# EAGLE design AIM65_FRAM (EAGLE 9.5.2)
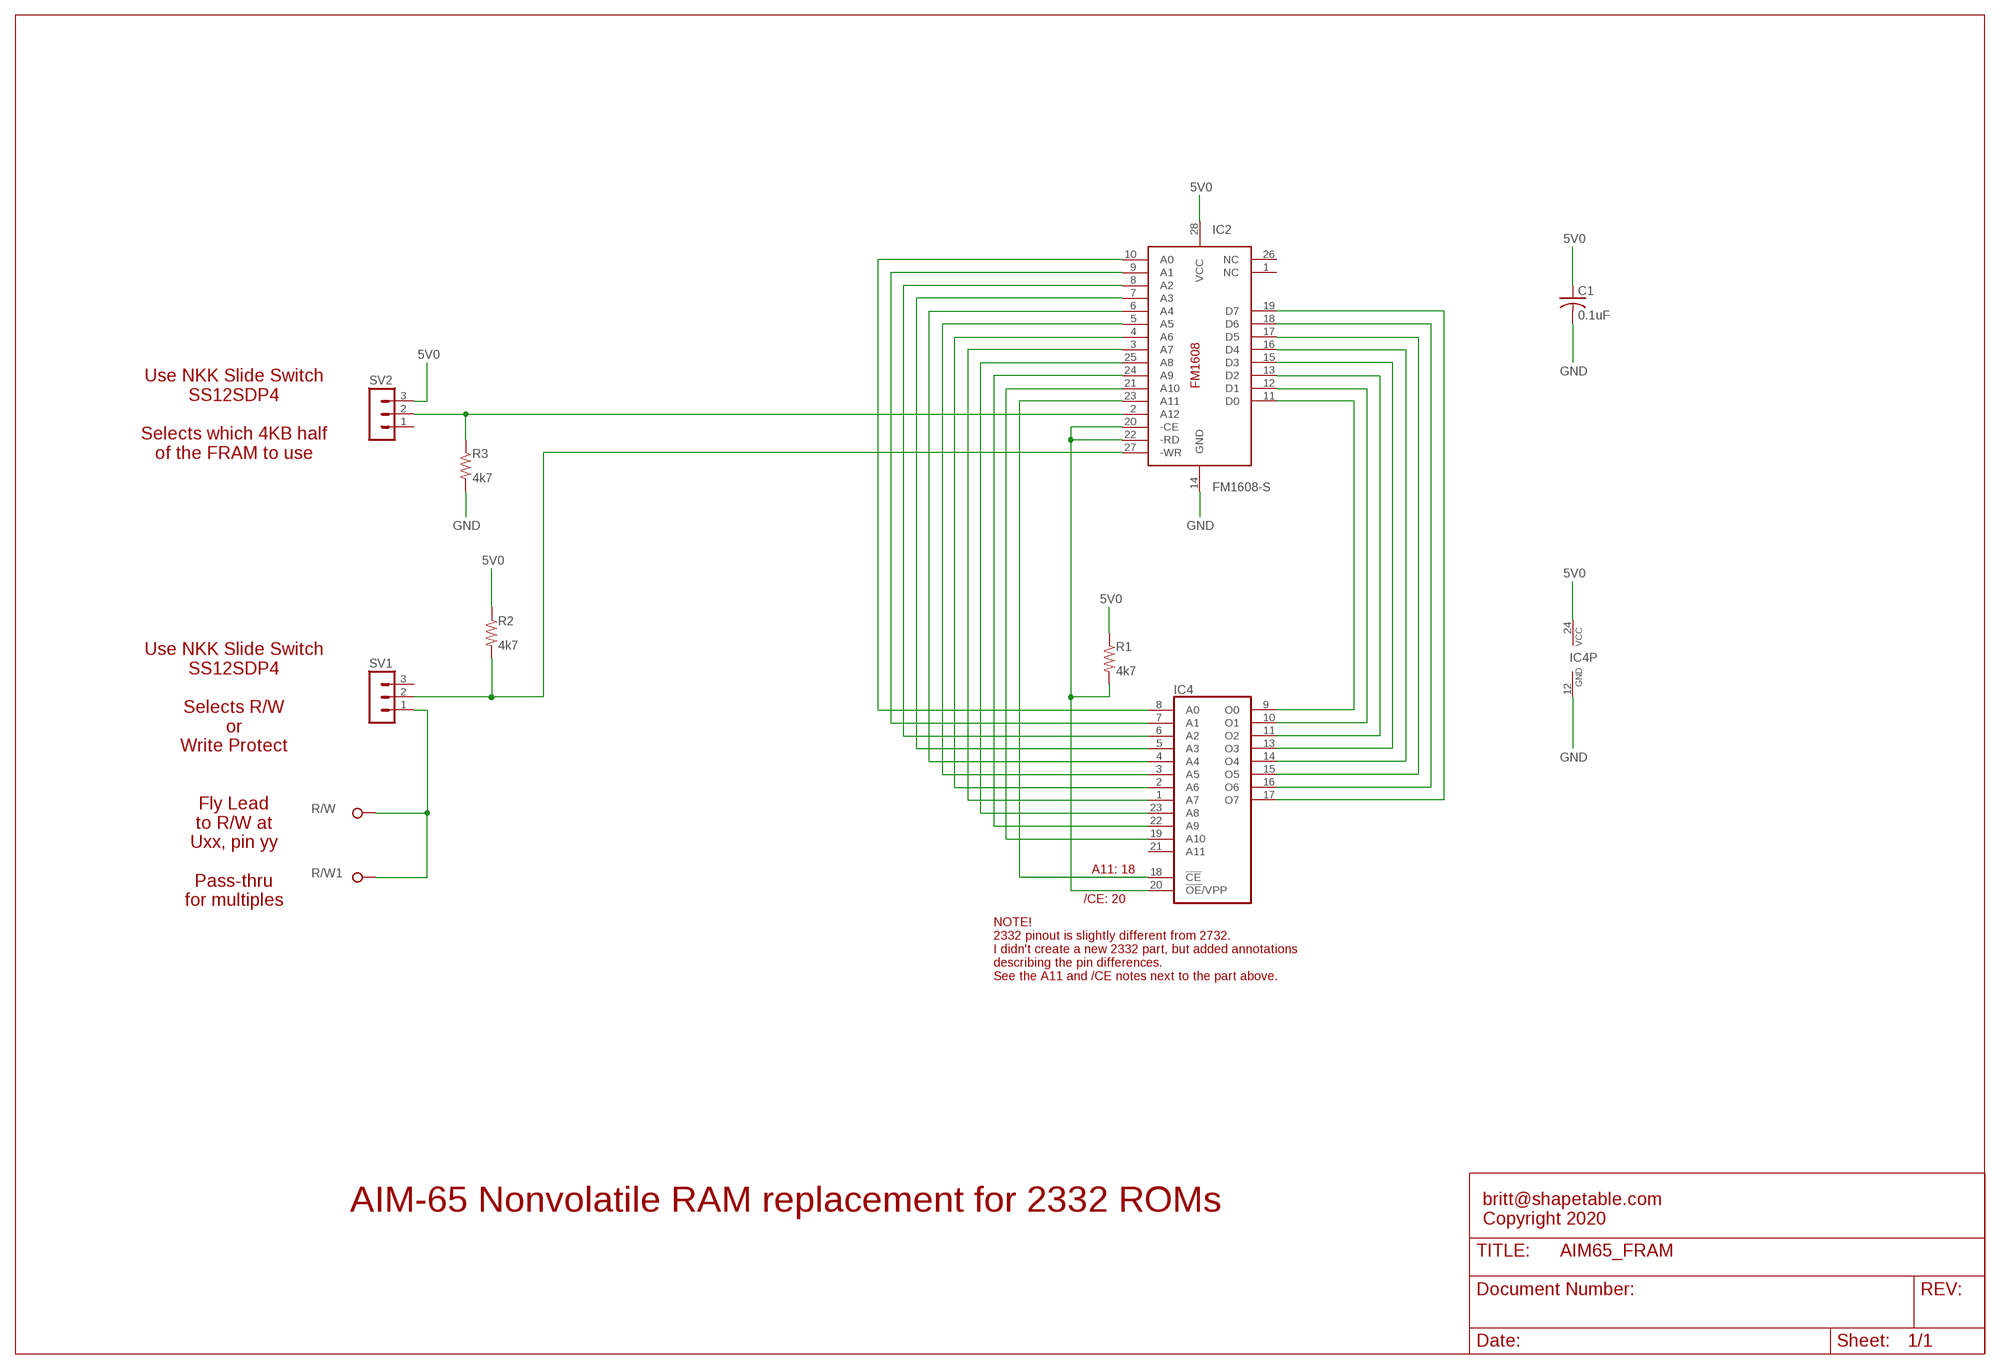
[diagram p0: schematic, sheet 1]

## Parts
C1  0.1uF  C-USC0603K  [C0603K]
IC2  FM1608-S  [SO-28W]
IC4  2732  [DIL24]
R1  4k7  R-US_R0603  [R0603]
R2  4k7  R-US_R0603  [R0603]
R3  4k7  R-US_R0603  [R0603]
R/W  JOE-TP-BIG  [JOE-TP-PKG-BIG]
R/W1  JOE-TP-BIG  [JOE-TP-PKG-BIG]
SV1  MA03-1  [MA03-1]
SV2  MA03-1  [MA03-1]

## Nets
5V0: C1.1 IC2.28(VCC) IC4.24(VCC) R1.1 R2.1 SV2.3
GND: C1.2 IC2.14(GND) IC4.12(GND) R3.2
N$1: IC2.10(A0) IC4.8(A0)
N$2: IC2.9(A1) IC4.7(A1)
N$3: IC2.8(A2) IC4.6(A2)
N$4: IC2.7(A3) IC4.5(A3)
N$5: IC2.6(A4) IC4.4(A4)
N$6: IC2.5(A5) IC4.3(A5)
N$7: IC2.4(A6) IC4.2(A6)
N$8: IC2.3(A7) IC4.1(A7)
N$9: IC2.25(A8) IC4.23(A8)
N$10: IC2.24(A9) IC4.22(A9)
N$11: IC2.21(A10) IC4.19(A10)
N$12: IC2.23(A11) IC4.18(!CE)
N$13: IC2.2(A12) R3.1 SV2.2
N$14: R/W1.1 R/W.1 SV1.1
N$15: IC2.20(-CE) IC2.22(-RD) IC4.20(!OE!/VPP) R1.2
N$16: IC2.27(-WR) R2.2 SV1.2
N$17: IC2.19(D7) IC4.17(O7)
N$18: IC2.18(D6) IC4.16(O6)
N$19: IC2.17(D5) IC4.15(O5)
N$20: IC2.16(D4) IC4.14(O4)
N$21: IC2.15(D3) IC4.13(O3)
N$22: IC2.13(D2) IC4.11(O2)
N$23: IC2.12(D1) IC4.10(O1)
N$24: IC2.11(D0) IC4.9(O0)
Unconnected: IC2.1(NC) IC2.26(NC) IC4.21(A11) SV1.3 SV2.1

## Notes on the sheet
- Use NKK Slide Switch
  SS12SDP4
  
  Selects which 4KB half
  of the FRAM to use
- Use NKK Slide Switch
  SS12SDP4
  
  Selects R/W
  or
  Write Protect
- Fly Lead
  to R/W at
  Uxx, pin yy
  
  Pass-thru
  for multiples
- A11: 18
- /CE: 20
- NOTE!
  2332 pinout is slightly different from 2732.
  I didn't create a new 2332 part, but added annotations
  describing the pin differences.
  See the A11 and /CE notes next to the part above.
- AIM-65 Nonvolatile RAM replacement for 2332 ROMs
- britt@shapetable.com
  Copyright 2020

## Library data of the parts
C1 = rcl:C-US: CAPACITOR, American symbol
IC2 = ramtron-2:FM1608: FM1608 8k x 8 NVRAM 5V (Jedec) DIP/SO-28W
IC4 = memory:2732: MEMORY
R1-R3 = rcl:R-US_: RESISTOR, American symbol
R/W R/W1 = joe-tp:JOE-TP-BIG
SV1 SV2 = con-lstb:MA03-1: PIN HEADER; OC_FARNELL: unknown; OC_NEWARK: unknown

## Board
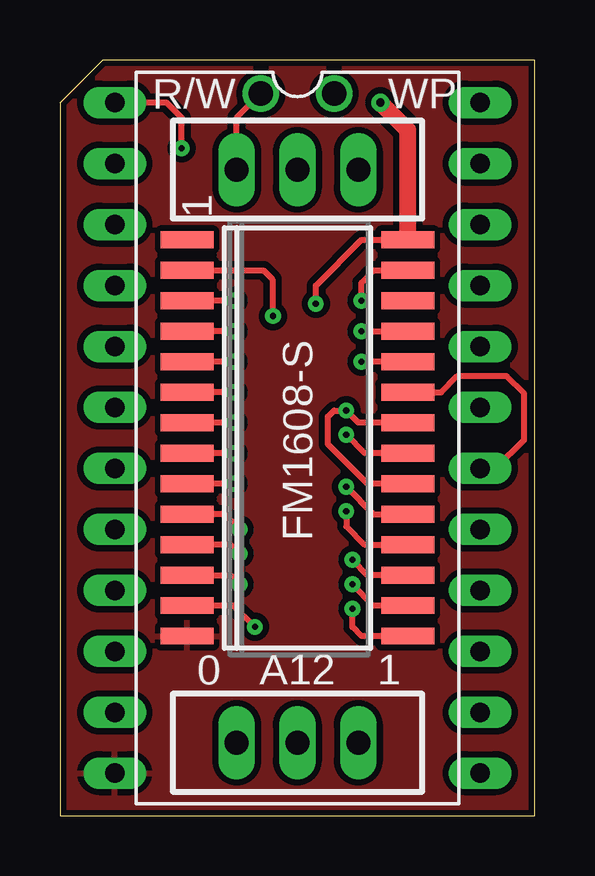
[diagram p1: board, top side]
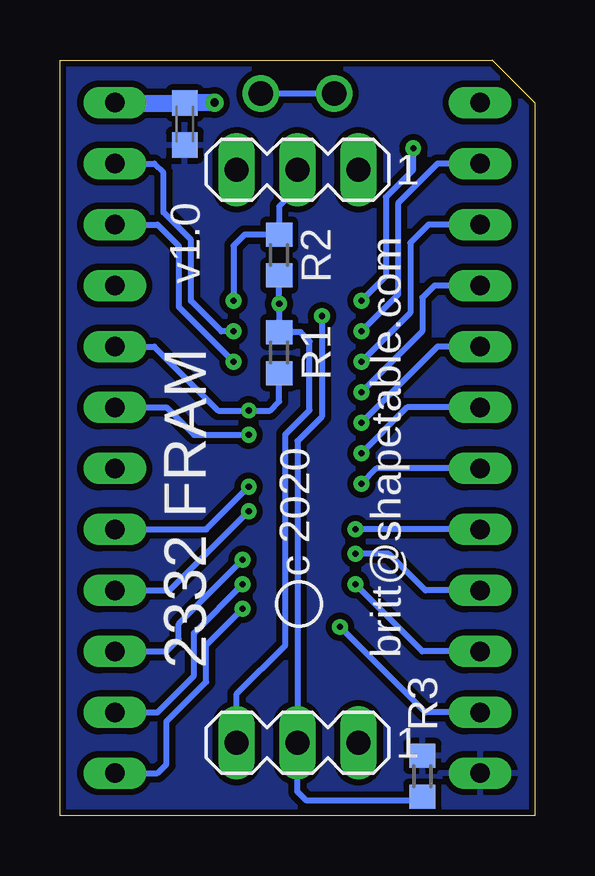
[diagram p2: board, bottom side, seen from below]

Size 19.81 x 31.5 mm. Coordinates in mm from the lower left corner, seen from the top.
Outline: 0,0 19.81,0 19.81,31.5 1.78,31.5 0,29.72 0,0
Copper layers (1*16): Top 0.035mm / dielectric 1.5mm / Bottom 0.035mm
Design rules "default *": minimum track width 6mil, minimum drill 10mil, track to track 10mil, track to pad 10mil, pad to pad 10mil, via to via 10mil, smd to smd 10mil, copper to edge 6mil, drill to drill 6mil, minimum pad ring 10mil, minimum via ring 8mil, stop-mask expansion 4mil, vias tented up to drill 10mil, thermal gap 10mil

### Footprints (pad centres in the part's own frame; a part is rotated, then mirrored left to right if it is on the bottom)
C0603K = smd 1.05 x 1.08: 1 -0.875,0; 2 0.875,0
SO-28W = smd 0.7 x 2.2: 1 -8.255,-4.6; 2 -6.985,-4.6; 3 -5.715,-4.6; 4 -4.445,-4.6; 5 -3.175,-4.6; 6 -1.905,-4.6; 7 -0.635,-4.6; 8 0.635,-4.6; 9 1.905,-4.6; 10 3.175,-4.6; 11 4.445,-4.6; 12 5.715,-4.6; 13 6.985,-4.6; 14 8.255,-4.6; 15 8.255,4.6; 16 6.985,4.6; 17 5.715,4.6; 18 4.445,4.6; 19 3.175,4.6; 20 1.905,4.6; 21 0.635,4.6; 22 -0.635,4.6; 23 -1.905,4.6; 24 -3.175,4.6; 25 -4.445,4.6; 26 -5.715,4.6; 27 -6.985,4.6; 28 -8.255,4.6
DIL24 = drill 0.813 long: 1 -13.97,-7.62; 2 -11.43,-7.62; 3 -8.89,-7.62; 4 -6.35,-7.62; 5 -3.81,-7.62; 6 -1.27,-7.62; 7 1.27,-7.62; 8 3.81,-7.62; 9 6.35,-7.62; 10 8.89,-7.62; 11 11.43,-7.62; 12 13.97,-7.62; 13 13.97,7.62; 14 11.43,7.62; 15 8.89,7.62; 16 6.35,7.62; 17 3.81,7.62; 18 1.27,7.62; 19 -1.27,7.62; 20 -3.81,7.62; 21 -6.35,7.62; 22 -8.89,7.62; 23 -11.43,7.62; 24 -13.97,7.62
R0603 = smd 1 x 1.1: 1 -0.85,0; 2 0.85,0
JOE-TP-PKG-BIG = drill 1.016: 1 0,0
MA03-1 = drill 1.016 long: 1 -2.54,0; 2 0,0; 3 2.54,0

### Placement (x,y rotation side)
C1  14.61,28.83 270 bottom
IC2  9.91,15.75 270 top
IC4  9.91,15.75 270 top
R1  10.67,19.3 270 bottom
R2  10.67,23.37 90 bottom
R3  4.7,1.65 90 bottom
R/W  8.38,30.1 0 top
R/W1  11.43,30.1 0 top
SV1  9.91,26.92 180 bottom
SV2  9.91,3.05 180 bottom

### Tracks (layer width: path | path; a pad name or v marks a point on that pad's centre or on a via)
5V0  (via drill 0.25, 0.35)
  Top 0.254: v10.67,21.34 10.67,22.1 12.57,24 IC2.28
  Top 0.711: IC2.28 14.51,28.58 v13.36,29.72
  Bottom 0.254: SV2.3 12.45,5.08 10.41,7.11 10.41,15.9 9.4,16.91 9.4,19.77 9.78,20.15 R1.1 v10.67,21.34 R2.1
  Bottom 0.635: 14.59,29.72 C1.1
  Bottom 0.711: IC4.24 17.51,29.7 C1.1 | v13.36,29.72 14.59,29.72
GND
  pour Top (isolate 0.254): -0.25,0 -0.25,32.26 20.07,32.26 20.07,0
  pour Bottom (isolate 0.254): -0.25,0 20.07,0 20.07,32.26 -0.25,32.26
N$1  (via drill 0.25)
  Top 0.254: v7.49,11.94 6.86,12.57 IC2.10
  Bottom 0.254: IC4.8 v7.49,11.94
N$2  (via drill 0.25)
  Top 0.254: v7.24,13.84 IC2.9
  Bottom 0.254: IC4.7 6.6,14.48 v7.24,13.84
N$3  (via drill 0.25)
  Top 0.254: v7.24,15.11 IC2.8
  Bottom 0.254: IC4.6 5.33,17.02 v7.24,15.11
N$4  (via drill 0.25)
  Top 0.254: v7.24,16.38 IC2.7
  Bottom 0.254: IC4.5 4.06,19.56 v7.24,16.38
N$5  (via drill 0.25)
  Top 0.254: v7.24,17.65 IC2.6
  Bottom 0.254: IC4.4 4.19,22.1 4.7,21.59 4.7,20.19 v7.24,17.65
N$6  (via drill 0.25)
  Top 0.254: v7.24,18.92 IC2.5
  Bottom 0.254: IC4.3 4.45,24.64 5.21,23.88 5.21,20.96 v7.24,18.92
N$7  (via drill 0.25)
  Top 0.254: v7.24,20.19 IC2.4
  Bottom 0.254: IC4.2 4.06,27.18 5.71,25.53 5.71,21.72 v7.24,20.19
N$8  (via drill 0.25)
  Top 0.254: v7.24,21.46 IC2.3 | v5.08,27.81 5.08,29.08 4.45,29.72 IC4.1
  Bottom 0.254: v5.08,27.81 5.08,26.92 6.22,25.78 6.22,22.48 v7.24,21.46
N$9  (via drill 0.25)
  Top 0.254: v12.57,20.19 IC2.25
  Bottom 0.254: IC4.23 15.88,27.18 15.49,26.8 15.49,25.15 14.35,24 14.35,21.46 13.08,20.19 v12.57,20.19
N$10  (via drill 0.25)
  Top 0.254: IC2.24 v12.57,18.92
  Bottom 0.254: IC4.22 15.75,24.64 14.86,23.75 14.86,21.21 v12.57,18.92
N$11  (via drill 0.25)
  Top 0.254: IC2.21 12.7,15.11 v11.94,15.88
  Bottom 0.254: IC4.19 15.37,17.02 14.22,15.88 v11.94,15.88
N$12
  Top 0.254: IC4.18 18.16,14.48 19.36,15.67 19.36,17.6 18.64,18.31 16.56,18.31 15.89,17.64 14.52,17.64 IC2.23
N$13  (via drill 0.25)
  Top 0.254: IC2.2 8.48,22.73 8.86,22.35 8.86,20.86 v8.89,20.83
  Bottom 0.254: v8.89,20.83 8.89,16.64 9.91,15.62 SV2.2 9.91,1.02 9.53,0.64 4.87,0.64 R3.1
N$14
  Top 0.254: R/W.1 7.37,29.08 SV1.1
  Bottom 0.254: R/W.1 R/W1.1
N$15  (via drill 0.25)
  Top 0.254: IC2.22 12.45,16.38 v11.94,16.89 11.43,16.89 11.18,16.64 11.18,15.49 12.83,13.84 IC2.20
  Bottom 0.254: IC4.20 15.88,19.56 13.21,16.89 v11.94,16.89 11.05,16.89 10.67,17.27 R1.2
N$16  (via drill 0.25)
  Top 0.254: v12.57,21.46 12.57,22.23 13.08,22.73 IC2.27
  Bottom 0.254: v12.57,21.46 12.57,23.75 12.1,24.22 R2.2 10.67,25.4 9.91,26.16 SV1.2
N$17  (via drill 0.25)
  Top 0.254: v11.94,13.72 13.08,12.57 IC2.19
  Bottom 0.254: IC4.17 13.72,11.94 v11.94,13.72
N$18  (via drill 0.25)
  Top 0.254: v11.94,12.7 11.94,12.07 12.7,11.3 IC2.18
  Bottom 0.254: IC4.16 15.24,9.4 v11.94,12.7
N$19  (via drill 0.25)
  Top 0.254: v12.19,10.67 12.83,10.03 IC2.17
  Bottom 0.254: IC4.15 15.37,6.86 14.86,7.37 14.86,8 v12.19,10.67
N$20  (via drill 0.25)
  Top 0.254: v12.19,9.65 13.08,8.76 IC2.16
  Bottom 0.254: IC4.14 15.75,4.32 14.22,5.84 14.22,7.62 v12.19,9.65
N$21  (via drill 0.25)
  Top 0.254: IC2.15 12.57,7.49 12.19,7.87 v12.19,8.64
  Bottom 0.254: IC4.13 15.75,1.78 15.37,2.16 15.37,3.94 13.72,5.59 13.72,7.11 v12.19,8.64
N$22  (via drill 0.25)
  Top 0.254: v8.13,7.87 7.24,8.76 IC2.13
  Bottom 0.254: IC4.11 4.57,4.32 v8.13,7.87
N$23  (via drill 0.25)
  Top 0.254: IC2.12 7.11,10.03 v7.49,9.65
  Bottom 0.254: IC4.10 4.7,6.86 v7.49,9.65
N$24  (via drill 0.25)
  Top 0.254: IC2.11 7.11,11.3 v7.49,10.92
  Bottom 0.254: v7.49,10.92 6.1,10.92 4.57,9.4 IC4.9

### Text on the board
tPlace: R/W | WP | 0 | A12 | 1
bPlace: v1.0 | britt@shapetable.com | c 2020 | 2332 FRAM